# Altium schematic sheet usb.SchDoc
size B
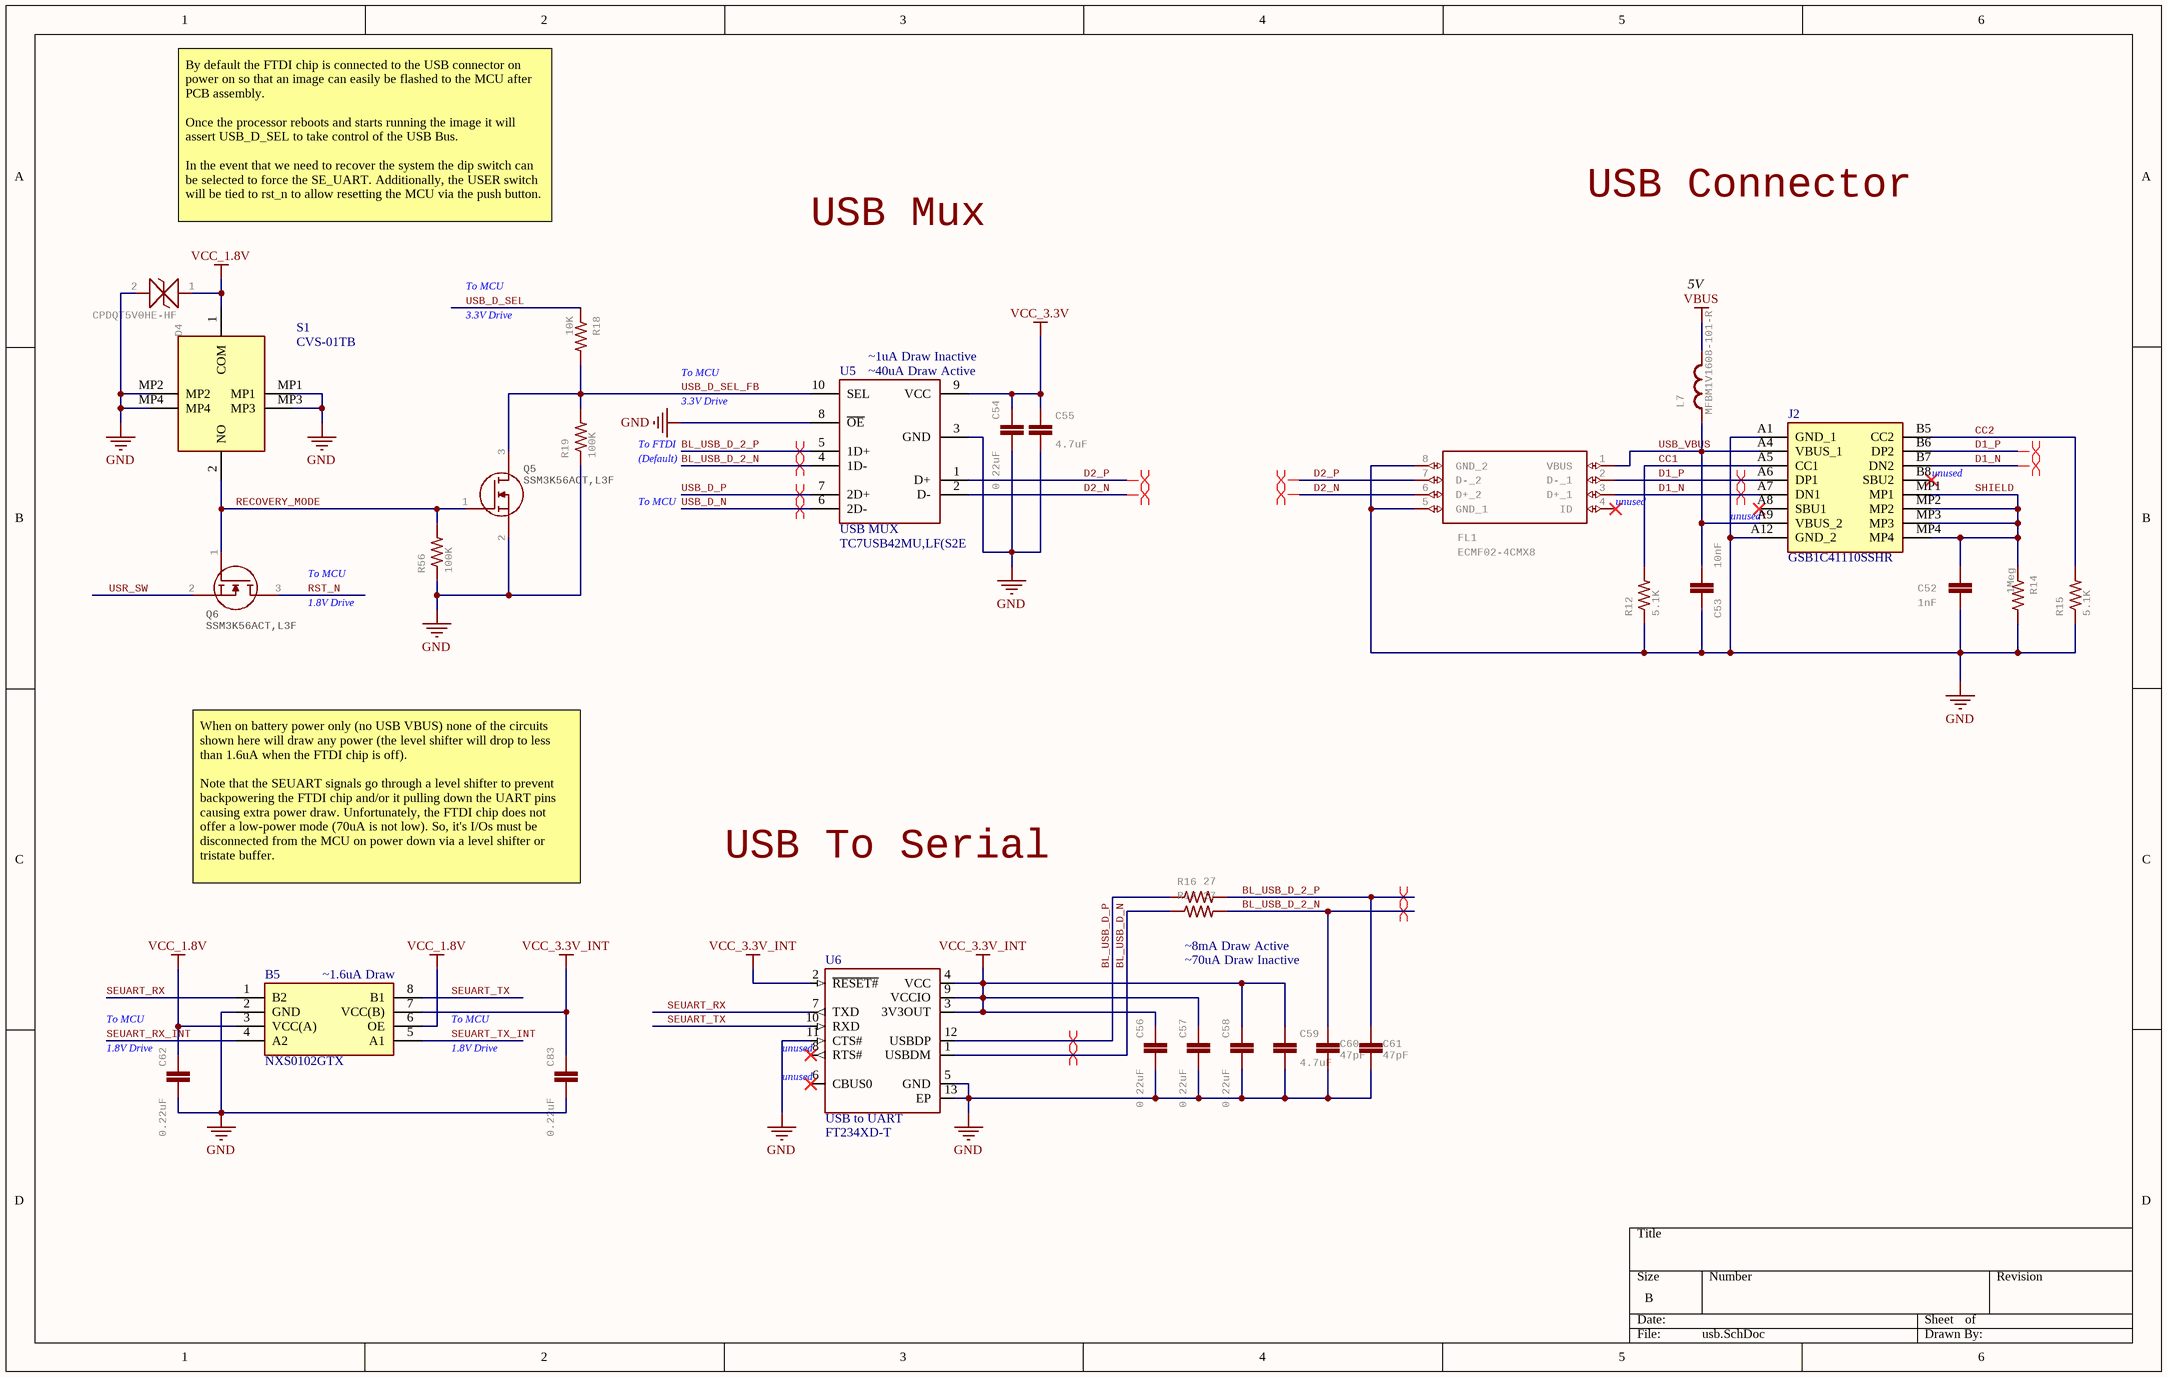
[diagram p0: usb.SchDoc]

## Parts
B5  NXS0102GTX  [NXS0102GTX]
C52  1nF  [0402-CAP]
C53  10nF  [0402-CAP]
C54  0.22uF  [C0201]
C55  4.7uF  [0402-CAP]
C56  0.22uF  [C0201]
C57  0.22uF  [C0201]
C58  0.22uF  [C0201]
C59  4.7uF  [0402-CAP]
C60  47pF  [C0201]
C61  47pF  [C0201]
C62  0.22uF  [C0201]
C83  0.22uF  [C0201]
D4  CPDQT5V0HE-HF  [CPDQT5V0HEHF]
FL1  ECMF02-4CMX8  [ECMF024CMX8]
J2  GSB1C41110SSHR  [GSB1C41110SSHR]
L7  MFBM1V1608-101-R  [0603-RES]
Q5  MPN: SSM3K56ACT,L3F  [DFN1006]  (hidden comment: NMOS)
Q6  MPN: SSM3K56ACT,L3F  [DFN1006]  (hidden comment: NMOS)
R12  5.1K  [R0201]
R14  1Meg  [0402-RES]
R15  5.1K  [R0201]
R16  27  [R0201]
R17  27  [R0201]
R18  10K  [R0201]
R19  100K  [R0201]
R56  100K  [R0201]
S1  CVS-01TB  [CVS01TB]
U5  USB MUX  [TC7USB42MU,LF(S2E]
U6  USB to UART  [SON45P300X300X80-13N]

## Nets
GND: B5.2(GND) C52.2 C53.1 C54.2 C55.1 C56.2 C57.2 C58.2 C59.1 C60.1 C61.1 C62.2 C83.2 D4.2 FL1.5(GND_1) FL1.8(GND_2) J2.A1(GND_1) J2.A12(GND_2) Q5.2(S) R12.1 R14.2 R15.1 R19.1 R56.1 S1.MP1 S1.MP2 S1.MP3 S1.MP4 U5.3(GND) U5.8(~{OE}) U6.5(GND) U6.11(CTS#) U6.13(EP)
VBUS: L7.2
VCC_1.8V: B5.3(VCC(A)) B5.6(OE) C62.1 D4.1 S1.1(COM)
VCC_3.3V: C54.1 C55.2 U5.9(VCC)
VCC_3.3V_INT: B5.7(VCC(B)) C56.1 C57.1 C58.1 C59.2 C83.1 U6.2(~{RESET#}) U6.3(3V3OUT) U6.4(VCC) U6.9(VCCIO)
BL_USB_D_2_N: C60.2 R17.2 U5.4(1D-)
BL_USB_D_2_P: C61.2 R16.2 U5.5(1D+)
BL_USB_D_N: R17.1 U6.1(USBDM)
BL_USB_D_P: R16.1 U6.12(USBDP)
CC1: J2.A5(CC1) R12.2
CC2: J2.B5(CC2) R15.2
D1_N: FL1.3(D+_1) J2.A7(DN1) J2.B7(DN2)
D1_P: FL1.2(D-_1) J2.A6(DP1) J2.B6(DP2)
D2_N: FL1.6(D+_2) U5.2(D-)
D2_P: FL1.7(D-_2) U5.1(D+)
RECOVERY_MODE: Q5.1(G) Q6.1(G) R56.2 S1.2(NO)
RST_N: Q6.3(D)
SEUART_RX: B5.1(B2) U6.7(TXD)
SEUART_RX_INT: B5.4(A2)
SEUART_TX: B5.8(B1) U6.10(RXD)
SEUART_TX_INT: B5.5(A1)
SHIELD: C52.1 J2.MP1 J2.MP2 J2.MP3 J2.MP4 R14.1
USB_D_N: U5.6(2D-)
USB_D_P: U5.7(2D+)
USB_D_SEL: R18.1
USB_D_SEL_FB: Q5.3(D) R18.2 R19.2 U5.10(SEL)
USB_VBUS: C53.2 FL1.1(VBUS) J2.A4(VBUS_1) J2.A9(VBUS_2) L7.1
USR_SW: Q6.2(S)

Not connected (* = marked no-connect by the designer): FL1 4(ID)*; J2 A8(SBU1)* B8(SBU2)*; U6 6(CBUS0)* 8(RTS#)*

## Layout directives
differential pair: BL_USB_D_2_N, BL_USB_D_2_P, BL_USB_D_N, BL_USB_D_P, D1_N, D1_P, D2_N, D2_P, USB_D_N, USB_D_P

## Notes on the sheet
- By default the FTDI chip is connected to the USB connector on power on so that an image can easily be flashed to the MCU after PCB assembly.
  Once the processor reboots and starts running the image it will assert USB_D_SEL to take control of the USB Bus.
  In the event that we need to recover the system the dip switch can be selected to force the SE_UART. Additionally, the USER switch will be tied to rst_n to allow resetting the MCU via the push button.
- USB Mux
- USB Connector
- To MCU
- 3.3V Drive
- 5V
- (near U5) ~1uA Draw Inactive
- (near U5) ~40uA Draw Active
- To FTDI
- (Default)
- (near FL1) unused
- (near J2) unused
- (near Q6) To MCU
- (near Q6) 1.8V Drive
- When on battery power only (no USB VBUS) none of the circuits shown here will draw any power (the level shifter will drop to less than 1.6uA when the FTDI chip is off).
  Note that the SEUART signals go through a level shifter to prevent backpowering the FTDI chip and/or it pulling down the UART pins causing extra power draw. Unfortunately, the FTDI chip does not offer a low-power mode (70uA is not low). So, it's I/Os must be disconnected from the MCU on power down via a level shifter or tristate buffer.
- USB To Serial
- ~70uA Draw Inactive
- ~8mA Draw Active
- (near B5) ~1.6uA Draw
- (near C62) 1.8V Drive
- 1.8V Drive
- (near U6) unused

## Library data of the parts
B5 = NXS0102GTX: Dual supply translating transceiver; open drain; auto direction sensing; Manufacturer_Name: Nexperia; Geometry.Height: 0.5mm; Mouser Part Number: 771-NXS0102GTX; Mouser Price/Stock: https://www.mouser.co.uk/ProductDetail/Nexperia/NXS0102GTX?qs=GBLSl2AkirukzzJX55VgJA%3D%3D; Manufacturer_Part_Number: NXS0102GTX; Datasheet Link: https://assets.nexperia.com/documents/data-sheet/NXS0102.pdf; MPN: NXS0102GTX; Part Number: NXS0102GTX
C52 = CAP0402-CAP: Capacitor; MPN: VJ0402Y102JXACW1BC; GateName_1: G$1; SymbolName_1: CAP; DeviceName: 0402-CAP; LibraryName: sfe; DeviceSetName: CAP; Part Number: VJ0402Y102JXACW1BC
C53 = C-EUC0201: CAPACITOR, European symbol; MPN: 0402B103K250CT; GateName_1: G$1; SymbolName_1: C-EU; POPULARITY: 0; LibraryName: rcl; DeviceSetName: C-EU; SPICEPREFIX: C; Part Number: 0402B103K250CT
C54 C56-C58 C62 C83 = C-EUC0201: CAPACITOR, European symbol; MPN: GRM033R60J224ME15D; GateName_1: G$1; SymbolName_1: C-EU; POPULARITY: 0; DeviceName: C0201; LibraryName: rcl; DeviceSetName: C-EU; SPICEPREFIX: C; Part Number: GRM033R60J224ME15D
C55 C59 = CAP0402-CAP: CapacitorStandard 0603 ceramic capacitor, and 0.1" leaded capacitor.; MPN: JMK105BBJ475MV-F; GateName_1: G$1; SymbolName_1: CAP; DeviceName: 0402-CAP; LibraryName: sfe; DeviceSetName: CAP; Part Number: JMK105BBJ475MV-F
C60 C61 = C-EUC0201: CAPACITOR, European symbol; MPN: GRM0335C1H470GA01J; GateName_1: G$1; SymbolName_1: C-EU; POPULARITY: 0; DeviceName: C0201; SPICEPREFIX: C; Part Number: GRM0335C1H470GA01J
D4 = CPDQT5V0HE-HF: ESD Suppressors / TVS Diodes DIODE ESD 5VWM 65W 0402/SOD-923F   Source:  Datasheet; MANUFACTURER_NAME: Comchip Technology; GateName_1: G$1; SymbolName_1: CPDQT5V0HE-HF; LibraryName: CPDQT5V0HE-HF; DeviceSetName: CPDQT5V0HE-HF; HEIGHT: 0.42mm; MANUFACTURER_PART_NUMBER: CPDQT5V0HE-HF; MOUSER_PART_NUMBER: MOUSER_PART_NUMBER; MOUSER_PRICE-STOCK: MOUSER_PRICE-STOCK; MPN: CPDQT5V0HE-HF; Part Number: CPDQT5V0HE-HF
FL1 = ECMF02-4CMX8: Common Mode Filter & ESD Prot. USB uQFN8 STMicroelectronics ECMF02 Series, Signal Filter uQFN SMD, Flat Contact Termination, 2.6 x 1.3 x 0.6mm   Source:  Datasheet; GateName_1: G$1; SymbolName_1: ECMF02-4CMX8; LibraryName: ECMF02-4CMX8; DeviceSetName: ECMF02-4CMX8; HEIGHT: mm; MANUFACTURER_NAME: STMicroelectronics; MANUFACTURER_PART_NUMBER: ECMF02-4CMX8; MOUSER_PART_NUMBER: 511-ECMF02-4CMX8; MOUSER_PRICE-STOCK: https://www.mouser.co.uk/ProductDetail/STMicroelectronics/ECMF02-4CMX8?qs=xYt8xtm2zhmK7GoDlDZR3A%3D%3D; MPN: ECMF02-4CMX8; Part Number: ECMF02-4CMX8
J2 = GSB1C41110SSHR: Connector; Manufacturer_Name: Amphenol Communications Solutions; Datasheet Link: https://cdn.amphenol-cs.com/media/wysiwyg/files/drawing/gsb1c41x10sshr-ax1.pdf; Height: 3.41mm; Manufacturer_Part_Number: GSB1C41110SSHR; Part Number: GSB1C41110SSHR; MPN: GSB1C41110SSHR
L7 = INDUCTOR: InductorsBasic Inductor/Choke - 0603 and 1206. Footprints are not proven and vary greatly between part numbers.; GateName_1: G$1; MPN: MFBM1V1608-101-R; Part Number: MFBM1V1608-101-R
R12 R15 = RESISTOR0402-RES: ResistorBasic schematic elements and footprints for 0603, 1206, and PTH resistors.; MPN: AC0201FR-075K1L; GateName_1: G$1; SymbolName_1: RESISTOR; LibraryName: sfe; DeviceSetName: RESISTOR; Part Number: AC0201FR-075K1L
R14 = RESISTOR0402-RES: Resistor; MPN: CRCW04021M00FKEDC; GateName_1: G$1; SymbolName_1: RESISTOR; DeviceName: 0402-RES; LibraryName: sfe; DeviceSetName: RESISTOR; Part Number: CRCW04021M00FKEDC
R16 R17 = RESISTOR0402-RES: MPN: RC0201JR-0727RL; GateName_1: G$1; SymbolName_1: RESISTOR; LibraryName: sfe; DeviceSetName: RESISTOR; Part Number: RC0201JR-0727RL
R18 = RESISTOR0402-RES: MPN: RMCF0201FT10K0; GateName_1: G$1; SymbolName_1: RESISTOR; LibraryName: sfe; DeviceSetName: RESISTOR; Part Number: RMCF0201FT10K0
R19 R56 = RESISTOR0402-RES: MPN: RMCF0201FT100K; GateName_1: G$1; SymbolName_1: RESISTOR; LibraryName: sfe; DeviceSetName: RESISTOR; Part Number: RMCF0201FT100K
S1 = CVS-01TB: Switch; Manufacturer_Name: Nidec Copal; Datasheet Link: https://www.mouser.com/datasheet/2/972/cvs-1827291.pdf; Height: 1.45mm; Manufacturer_Part_Number: CVS-01TB; Mouser Part Number: 229-CVS-01TB; Mouser Price/Stock: https://www.mouser.co.uk/ProductDetail/Nidec-Components/CVS-01TB?qs=XeJtXLiO41SVso1ahlfkxQ%3D%3D; Arrow Part Number: CVS-01TB; Arrow Price/Stock: https://www.arrow.com/en/products/cvs-01tb/nidec-copal-electronics; Part Number: CVS-01TB; MPN: CVS-01TB
U5 = TC7USB42MU,LF(S2E: MF: Toshiba; MPN: TC7USB42MU,LF(S2E; Part Number: TC7USB42MU,LF(S2E
U6 = FT234XD-T: USB Bridge, USB to UART USB 2.0 UART Interface 12-DFN _3x3_; MF: FTDI,; Part Number: FT234XD-T; MPN: FT234XD-T
Q5 Q6 = NMOS: Part Number: SSM3K56ACT,L3F